# Altium schematic sheet Touch_pad.SchDoc
size A4; SheetNumber: 3; SheetTotal: 6
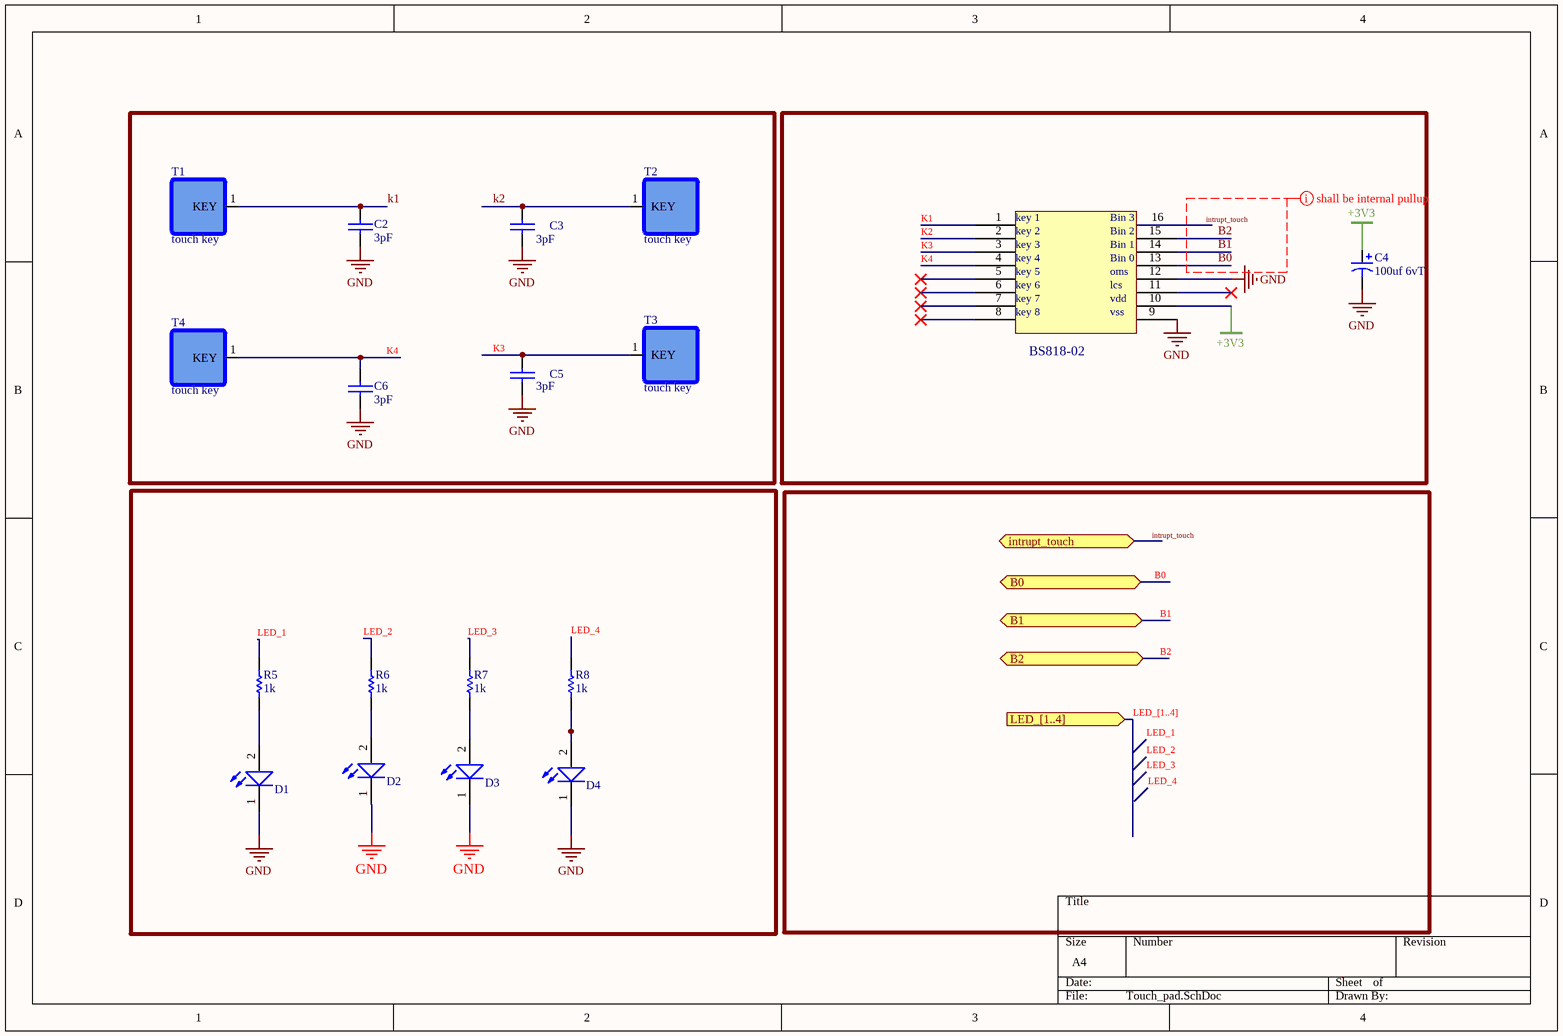
[diagram p0: Touch_pad.SchDoc]

## Parts
BS1  BS818-02  [SOIC127P600X175-16N]  (value not drawn)
C2  3pF  [RES 0603 (1608X06L)]
C3  3pF  [RES 0603 (1608X06L)]
C4  100uf 6vT  [B]
C5  3pF  [RES 0603 (1608X06L)]
C6  3pF  [RES 0603 (1608X06L)]
D1  LED SMD PACKAGE  [LED_SMD_0805]  (value not drawn)
D2  LED SMD PACKAGE  [LED_SMD_0805]  (value not drawn)
D3  LED SMD PACKAGE  [LED_SMD_0805]  (value not drawn)
D4  LED SMD PACKAGE  [LED_SMD_0805]  (value not drawn)
R5  1k  [RES 0603 (1608X06L)]
R6  1k  [RES 0603 (1608X06L)]
R7  1k  [RES 0603 (1608X06L)]
R8  1k  [RES 0603 (1608X06L)]
T1  touch key  [Touch_key]
T2  touch key  [Touch_key]
T3  touch key  [Touch_key]
T4  touch key  [Touch_key]

## Ports
B0 (bidir), B1 (bidir), B2 (bidir), intrupt_touch (bidir), LED_[1..4] (in)

## Nets
+3V3: BS1.10 C4.1
GND: BS1.9 BS1.12 C2.1 C3.1 C4.2 C5.1 C6.1 D1.1(K) D2.1(K) D3.1(K) D4.1(K)
B0: BS1.13 ; port B0
B1: BS1.14 ; port B1
B2: BS1.15 ; port B2
intrupt_touch: BS1.16 ; port intrupt_touch
k1: BS1.1 C2.2 T1.1(KEY)
K2: BS1.2 C3.2 T2.1(KEY)
K3: BS1.3 C5.2 T3.1(KEY)
K4: BS1.4 C6.2 T4.1(KEY)
LED_1: R5.1
LED_2: R6.1
LED_3: R7.1
LED_4: R8.1
NetD1_2: D1.2(A) R5.2
NetD2_2: D2.2(A) R6.2
NetD3_2: D3.2(A) R7.2
NetD4_2: D4.2(A) R8.2

Not connected (* = marked no-connect by the designer): BS1 5* 6* 7* 8* 11*

## Buses and harness runs
bus LED_[1..4] = port LED_[1..4]

## Layout directives
mark named shall be internal pullup: B0, B1, B2, intrupt_touch

## Notes on the sheet
- Labels drawn without touching a wire or pin: LED_1, LED_2, LED_3, LED_4
- (in symbol Component_1) key 1; Bin 3; key 2; Bin 2; key 3; Bin 1; key 4; Bin 0; key 5; oms; key 6; lcs; key 7; vdd; key 8; vss

## Library data of the parts
BS1 = Component_1
C2 C3 C5 C6 = CAP: Capacitor; Value: 3pF
C4 = T494B: Cap/Tantalum/SMD/B; Published: 17-Jul-2002; LatestRevisionDate: 19-Mar-2004; LatestRevisionNote: Silkscreen dimensions re-sized.; DatasheetDocument: Mar-2001; PackageDocument: Mar-2001; PackageReference: B; Publisher: Altium Limited; Code_JEITA: 3528-21; ComponentLink1Description: Manufacturer Link; ComponentLink1URL: http://www.kemet.com/; ComponentLink2Description: Datasheet; ComponentLink2URL: http://www.kemet.com/kemet/web/homepage/kechome.nsf/vapubfilesname/F3102TA.pdf/$file/F3102TA.pdf
D1-D4 = LED SMD PACKAGE: SMD Mono-color Chip LED Waterclear; Part Number: 150080BS75000; Peak Wavelength: 465 nm; Forward Voltage: 3.2 V; Published Date: Jan 2017; Publisher: Ali Hafizi
R5-R8 = Res1: Resistor; Published: 8-Jun-2000; LatestRevisionDate: 17-Jul-2002; LatestRevisionNote: Re-released for DXP Platform.; PackageReference: AXIAL-0.3; Publisher: Altium Limited; Value: 1k